# Altium schematic sheet ui-pcb.SchDoc
size A4; SheetNumber: 1; SheetTotal: 8
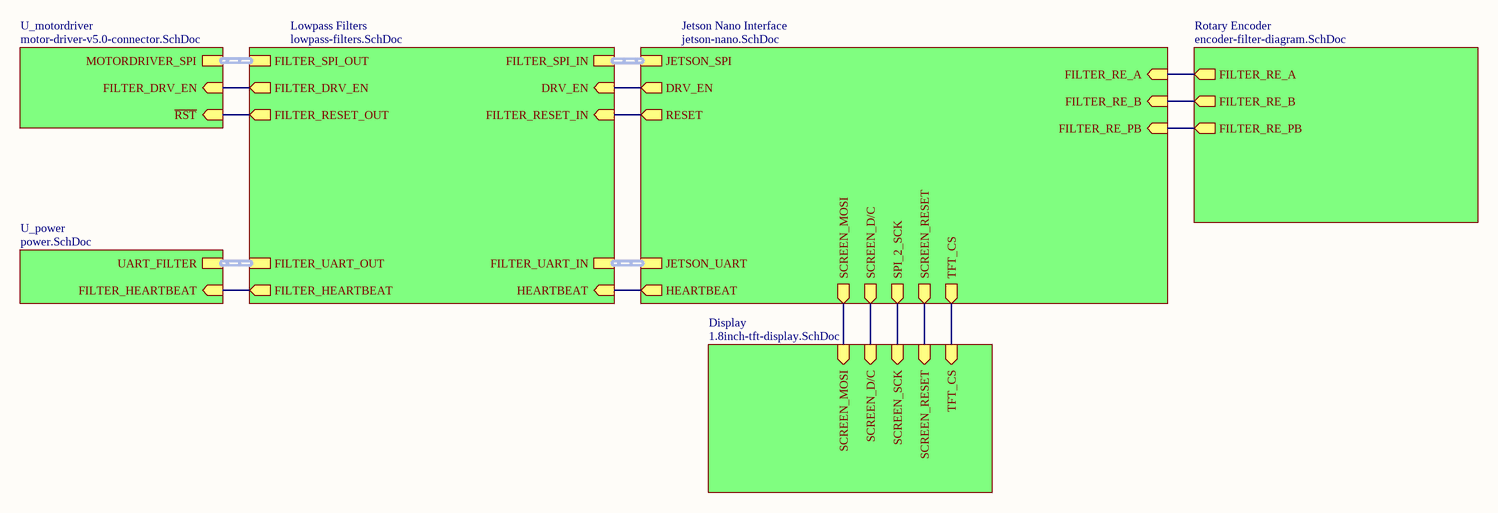
[diagram p0: ui-pcb.SchDoc]

## Sub-sheets
Display = 1.8inch-tft-display.SchDoc: SCREEN_MOSI (in), SCREEN_D/C (in), SCREEN_SCK (in), SCREEN_RESET (in), TFT_CS (in)
Jetson Nano Interface = jetson-nano.SchDoc: JETSON_UART (harness POWER_UART_IN), HEARTBEAT (out), JETSON_SPI (harness MOTORDRIVER_SPI_IN), DRV_EN (out), RESET (out), FILTER_RE_A (in), FILTER_RE_B (in), FILTER_RE_PB (in), SCREEN_MOSI (out), SCREEN_D/C (out), SPI_2_SCK (out), SCREEN_RESET (out), TFT_CS (out)
Lowpass Filters = lowpass-filters.SchDoc: FILTER_SPI_IN (harness MOTORDRIVER_SPI_IN), DRV_EN (in), FILTER_RESET_IN (in), FILTER_SPI_OUT (harness MOTORDRIVER_SPI), FILTER_DRV_EN (out), FILTER_RESET_OUT (out), FILTER_UART_IN (harness POWER_UART_IN), HEARTBEAT (in), FILTER_UART_OUT (harness UART_FILTERED_SIGNALS), FILTER_HEARTBEAT (out)
Rotary Encoder = encoder-filter-diagram.SchDoc: FILTER_RE_PB (out), FILTER_RE_B (out), FILTER_RE_A (out)
U_motordriver = motor-driver-v5.0-connector.SchDoc: MOTORDRIVER_SPI (harness MOTORDRIVER_SPI), ~{RST} (in), FILTER_DRV_EN (in)
U_power = power.SchDoc: UART_FILTER (harness UART_FILTERED_SIGNALS), FILTER_HEARTBEAT (in)

## Nets
(unnamed): sheet Jetson Nano Interface/HEARTBEAT, sheet Lowpass Filters/HEARTBEAT
(unnamed): sheet Jetson Nano Interface/DRV_EN, sheet Lowpass Filters/DRV_EN
(unnamed): sheet Jetson Nano Interface/RESET, sheet Lowpass Filters/FILTER_RESET_IN
(unnamed): sheet Jetson Nano Interface/FILTER_RE_A, sheet Rotary Encoder/FILTER_RE_A
(unnamed): sheet Jetson Nano Interface/FILTER_RE_B, sheet Rotary Encoder/FILTER_RE_B
(unnamed): sheet Jetson Nano Interface/FILTER_RE_PB, sheet Rotary Encoder/FILTER_RE_PB
(unnamed): sheet Jetson Nano Interface/SCREEN_MOSI, sheet Display/SCREEN_MOSI
(unnamed): sheet Jetson Nano Interface/SCREEN_D/C, sheet Display/SCREEN_D/C
(unnamed): sheet Jetson Nano Interface/SPI_2_SCK, sheet Display/SCREEN_SCK
(unnamed): sheet Jetson Nano Interface/SCREEN_RESET, sheet Display/SCREEN_RESET
(unnamed): sheet Jetson Nano Interface/TFT_CS, sheet Display/TFT_CS
(unnamed): sheet U_power/FILTER_HEARTBEAT, sheet Lowpass Filters/FILTER_HEARTBEAT
(unnamed): sheet U_motordriver/~{RST}, sheet Lowpass Filters/FILTER_RESET_OUT
(unnamed): sheet U_motordriver/FILTER_DRV_EN, sheet Lowpass Filters/FILTER_DRV_EN

## Buses and harness runs
harness sheet Jetson Nano Interface/JETSON_SPI = sheet Lowpass Filters/FILTER_SPI_IN
harness sheet Jetson Nano Interface/JETSON_UART = sheet Lowpass Filters/FILTER_UART_IN
harness sheet Lowpass Filters/FILTER_SPI_OUT = sheet U_motordriver/MOTORDRIVER_SPI
harness sheet Lowpass Filters/FILTER_UART_OUT = sheet U_power/UART_FILTER